# Altium schematic sheet stm32平衡车.SchDoc
size A4
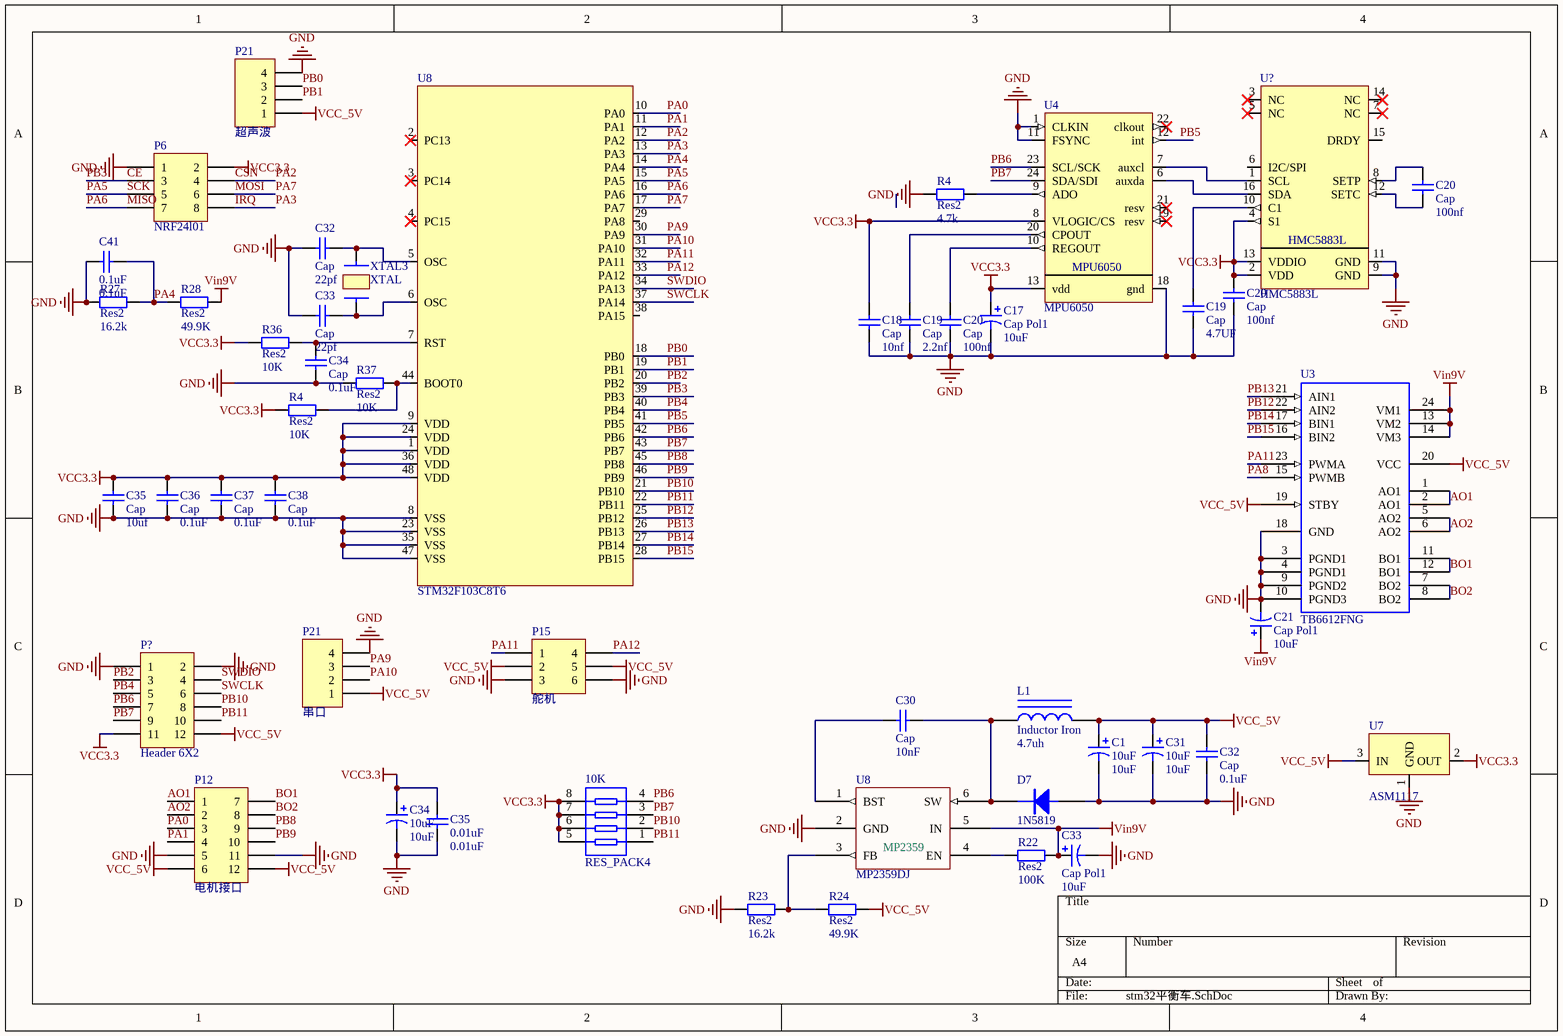
[diagram p0: stm32平衡车.SchDoc]

## Parts
(Parts that share a designator on the sheet are numbered #1, #2 ... from top to bottom, then left to right.)
10K  RES_PACK4  [RES4]
C1  10uF  [6-0805]
C17  Cap Pol1  value 10uF  [3216[1206]]
C18  Cap  value 10nf  [L0603]
C19#1  Cap  value 4.7UF  [L0603]
C19#2  Cap  value 2.2nf  [L0603]
C20#1  Cap  value 100nf  [J1-0603]
C20#2  Cap  value 100nf  [J1-0603]
C20#3  Cap  value 100nf  [J1-0603]
C21  Cap Pol1  value 10uF  [LC-1206_C]
C30  Cap  value 10nF  [LC-0603_C]
C31  10uF  [电容HONOR_63X54]
C32#1  Cap  value 22pf  [L0603]
C32#2  Cap  value 0.1uF  [LC-0603_C]
C33#1  Cap  value 22pf  [L0603]
C33#2  Cap Pol1  value 10uF  [电容HONOR_63X54]
C34#1  Cap  value 0.1uF  [L0603]
C34#2  10uF  [电容HONOR_63X54]
C35#1  Cap  value 10uf  [6-0805]
C35#2  0.01uF  [LC-0603_C]
C36  Cap  value 0.1uF  [L0603]
C37  Cap  value 0.1uF  [L0603]
C38  Cap  value 0.1uF  [L0603]
C41  0.1uF  [LC-0603_C]
D7  1N5819  [SMA]
L1  Inductor Iron  value 4.7uh  [电感GDCD4532]
P6  NRF24l01  [HDR2X4]
P12  电机接口  [HDR2X6_CEN]
P15  舵机  [HDR2X3_CEN]
P21#1  超声波  [HDR1X4]
P21#2  串口  [HDR1X4]
P?  Header 6X2  [HDR2X6]
R4#1  Res2  value 4.7k  [0603]
R4#2  Res2  value 10K  [0603]
R22  Res2  value 100K  [LC-0603]
R23  Res2  value 16.2k  [LC-0603]
R24  Res2  value 49.9K  [LC-0603]
R27  Res2  value 16.2k  [LC-0603]
R28  Res2  value 49.9K  [LC-0603]
R36  Res2  value 10K  [1608[0603]]
R37  Res2  value 10K  [1608[0603]]
U3  TB6612FNG  [SSOP24]
U4  MPU6050  [qfn24]
U7  ASM1117  [SOT223]
U8#1  STM32F103C8T6  [LQFP48_L]
U8#2  MP2359DJ  [SOT23-6]
U?  HMC5883L  [HMC5883L]
XTAL3  XTAL  [49SMD - duplicate]

## Nets
GND: C1.2 C17.2 C18.1 C19#1.1 C19#2.1 C20#2.1 C20#3.1 C21.2 C31.2 C32#1.1 C32#2.1 C33#1.1 C33#2.2 C34#1.1 C34#2.2 C35#1.1 C35#2.2 C36.1 C37.1 C38.1 C41.2 D7.A P6.1 P12.5 P12.11 P15.3 P15.6 P21#1.4 P21#2.4 P?.1 P?.2 R4#1.1 R23.2 R27.2 R37.1 U3.3(PGND1) U3.4(PGND1) U3.9(PGND2) U3.10(PGND3) U3.18(GND) U4.1(CLKIN) U4.11(FSYNC) U4.18(gnd) U7.1(GND) U8#1.8(VSS) U8#1.23(VSS) U8#1.35(VSS) U8#1.47(VSS) U8#2.2(GND) U?.9(GND) U?.11(GND)
VCC3.3: 10K.5 10K.6 10K.7 10K.8 C17.1 C18.2 C20#2.2 C34#2.1 C35#1.2 C35#2.1 C36.2 C37.2 C38.2 P6.2 P?.11 R4#2.1 R36.1 U4.8(VLOGIC/CS) U4.13(vdd) U7.2(OUT) U8#1.1(VDD) U8#1.9(VDD) U8#1.24(VDD) U8#1.36(VDD) U8#1.48(VDD) U?.2(VDD) U?.4(S1) U?.13(VDDIO)
VCC_5V: C1.1 C31.1 C32#2.2 L1.2 P12.6 P12.12 P15.2 P15.5 P21#1.1 P21#2.1 P?.12 R24.1 U3.19(STBY) U3.20(VCC) U7.3(IN)
Vin9V: C21.1 C33#2.1 R22.2 R28.1 U3.13(VM2) U3.14(VM3) U3.24(VM1) U8#2.5(IN)
AO1: P12.1 U3.1(AO1) U3.2(AO1)
AO2: P12.2 U3.5(AO2) U3.6(AO2)
BO1: P12.7 U3.11(BO1) U3.12(BO1)
BO2: P12.8 U3.7(BO2) U3.8(BO2)
CE: P6.3 U8#1.39(PB3)  [also labelled PB3]
CSN: P6.4 U8#1.12(PA2)  [also labelled PA2]
IRQ: P6.8 U8#1.13(PA3)  [also labelled PA3]
MISO: P6.7 U8#1.16(PA6)  [also labelled PA6]
MOSI: P6.6 U8#1.17(PA7)  [also labelled PA7]
PA0: P12.3 U8#1.10(PA0)
PA1: P12.4 U8#1.11(PA1)
PA4: C41.1 R27.1 R28.2 U8#1.14(PA4)
PA5: P6.5 U8#1.15(PA5)  [also labelled SCK]
PA8: U3.15(PWMB)
PA9: P21#2.3 U8#1.30(PA9)
PA10: P21#2.2 U8#1.31(PA10)
PA11: P15.1 U3.23(PWMA) U8#1.32(PA11)
PA12: P15.4 U8#1.33(PA12)
PB0: P21#1.3 U8#1.18(PB0)
PB1: P21#1.2 U8#1.19(PB1)
PB2: P?.3 U8#1.20(PB2)
PB4: P?.5 U8#1.40(PB4)
PB5: U4.12(int) U8#1.41(PB5)
PB6: 10K.4 P?.7 U4.23(SCL/SCK) U8#1.42(PB6)
PB7: 10K.3 P?.9 U4.24(SDA/SDI) U8#1.43(PB7)
PB8: P12.9 U8#1.45(PB8)
PB9: P12.10 U8#1.46(PB9)
PB10: 10K.2 P?.8 U8#1.21(PB10)
PB11: 10K.1 P?.10 U8#1.22(PB11)
PB12: U3.22(AIN2) U8#1.25(PB12)
PB13: U3.21(AIN1) U8#1.26(PB13)
PB14: U3.17(BIN1) U8#1.27(PB14)
PB15: U3.16(BIN2) U8#1.28(PB15)
SWCLK: P?.6 U8#1.37(PA14)
SWDIO: P?.4 U8#1.34(PA13)
NetC19#1_2: C19#1.2 U?.10(C1)
NetC19#2_2: C19#2.2 U4.20(CPOUT)
NetC20#1_1: C20#1.1 U?.12(SETC)
NetC20#1_2: C20#1.2 U?.8(SETP)
NetC20#3_2: C20#3.2 U4.10(REGOUT)
NetC30_1: C30.1 U8#2.1(BST)
NetC30_2: C30.2 D7.K L1.1 U8#2.6(SW)
NetC32#1_2: C32#1.2 U8#1.5(OSC) XTAL3.1
NetC33#1_2: C33#1.2 U8#1.6(OSC) XTAL3.2
NetC34#1_2: C34#1.2 R36.2 U8#1.7(RST)
NetR4#1_2: R4#1.2 U4.9(ADO)
NetR4#2_2: R4#2.2 R37.2 U8#1.44(BOOT0)
NetR22_1: R22.1 U8#2.4(EN)
NetR23_1: R23.1 R24.2 U8#2.3(FB)
NetU4_6: U4.6(auxda) U?.16(SDA)
NetU4_7: U4.7(auxcl) U?.1(SCL)

Not connected (* = marked no-connect by the designer): U4 19(resv)* 21(resv)* 22(clkout)*; U8#1 2(PC13)* 3(PC14)* 4(PC15)* 29(PA8) 38(PA15); U? 3(NC)* 5(NC)* 6(I2C/SPI) 7(NC)* 14(NC)* 15(DRDY)

## Notes on the sheet
- (in symbol MP2359DJ) MP2359

## Library data of the parts
C1 C17 C21 C31 C33#2 C34#2 = Cap Pol1: Polarized Capacitor (Radial); Published: 8-Jun-2000; LatestRevisionDate: 17-Jul-2002; LatestRevisionNote: Re-released for DXP Platform.; PackageReference: RB7.6-15; Publisher: Altium Limited
  C1 C31 C34#2: Value: 10uF
C18 C19#1 C19#2 C20#1-C20#3 C30 C32#1 C32#2 C33#1 C34#1 C35#1 C35#2 C36-C38 C41 = Cap: Capacitor; Published: 8-Jun-2000; LatestRevisionDate: 17-Jul-2002; LatestRevisionNote: Re-released for DXP Platform.; PackageReference: RAD-0.3; Publisher: Altium Limited
  C35#2: Value: 0.01uF
  C41: Value: 0.1uF
D7 = 1N4001: pin to pad: A>1 K>2
L1 = Inductor Iron: Magnetic-Core Inductor; Published: 24-Mar-1999; LatestRevisionDate: 17-Jul-2002; LatestRevisionNote: Re-released for DXP Platform.; PackageReference: AXIAL-0.9; Publisher: Altium Limited
P6 = Header 4X2: Header, 4-Pin, Dual row; LatestRevisionDate: 17-Jul-2002; LatestRevisionNote: Re-released for DXP Platform.; Publisher: Altium Limited
P12 = Header 6X2A: Header, 6-Pin, Dual row; LatestRevisionDate: 17-Jul-2002; LatestRevisionNote: Re-released for DXP Platform.; Publisher: Altium Limited
P15 = Header 3X2A: Header, 3-Pin, Dual row; LatestRevisionDate: 17-Jul-2002; LatestRevisionNote: Re-released for DXP Platform.; Publisher: Altium Limited
P21#1 P21#2 = Header 4: Header, 4-Pin; LatestRevisionDate: 17-Jul-2002; LatestRevisionNote: Re-released for DXP Platform.; Publisher: Altium Limited
P? = Header 6X2: Header, 6-Pin, Dual row; LatestRevisionDate: 17-Jul-2002; LatestRevisionNote: Re-released for DXP Platform.; Publisher: Altium Limited
R4#1 R4#2 R22-R24 R27 R28 R36 R37 = Res2: Resistor; Published: 8-Jun-2000; LatestRevisionDate: 17-Jul-2002; LatestRevisionNote: Re-released for DXP Platform.; PackageReference: AXIAL-0.4; Publisher: Altium Limited